# Altium project mother board.PrjPcb
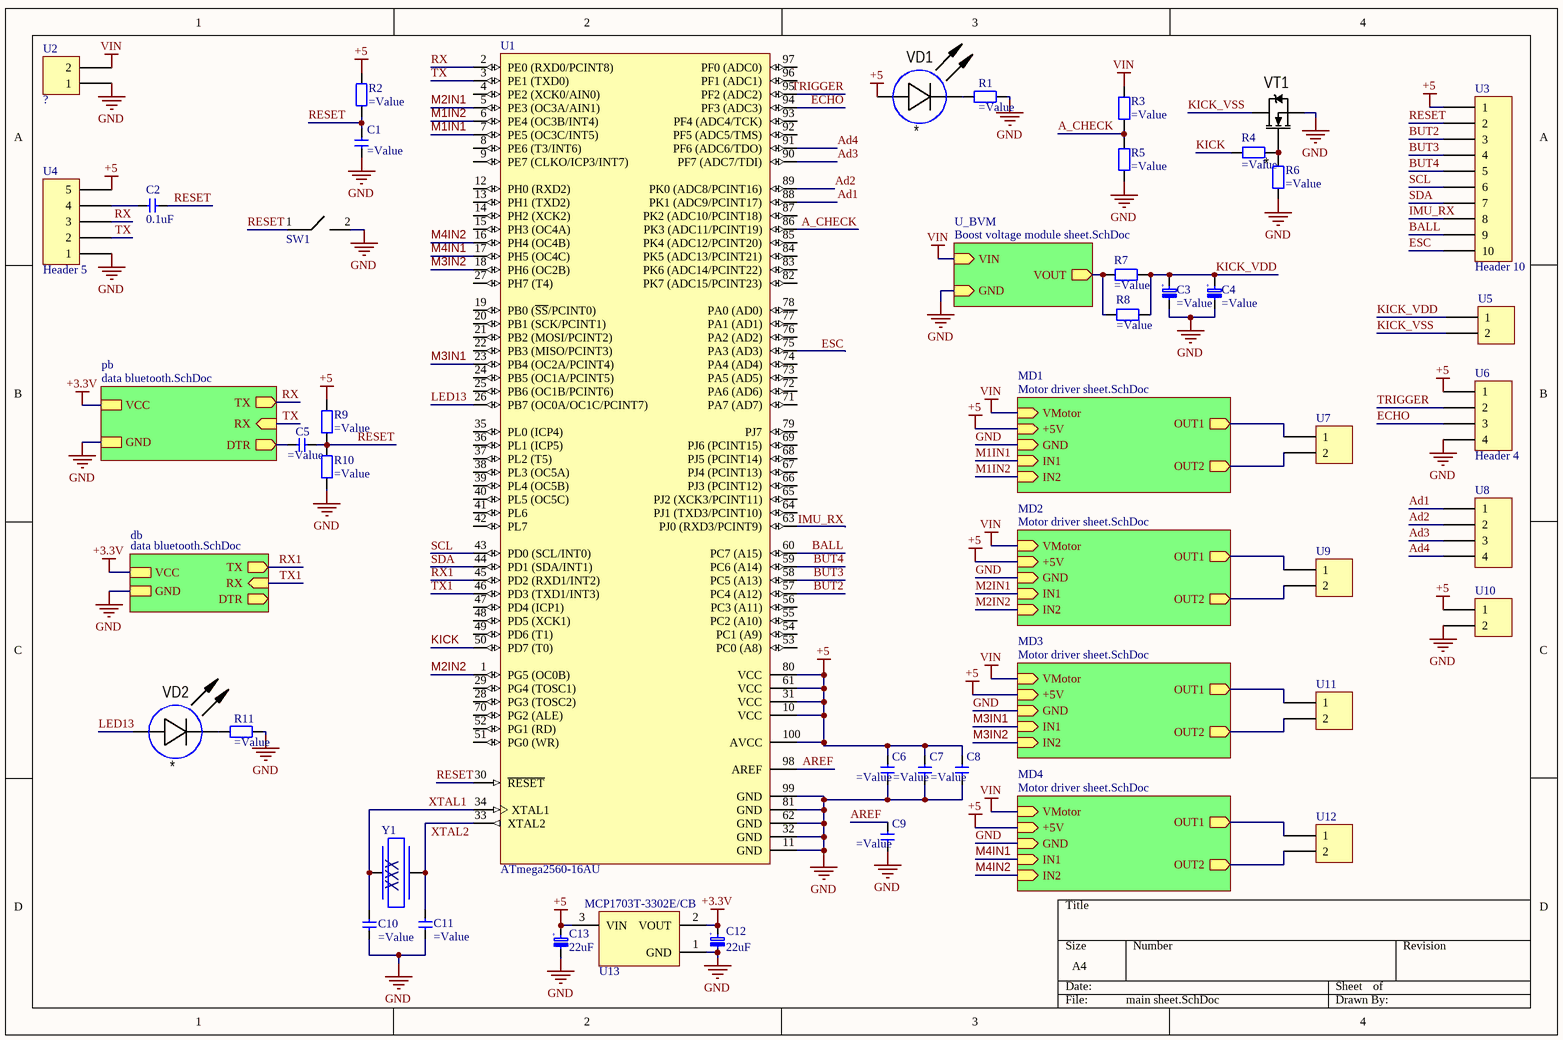
[diagram p0: main sheet.SchDoc]
4 sheets, 73 parts. Net scope: hierarchical (ports join the sheet entries above them; power ports are global).
Board file: mother board.PcbDoc
Sheets:
  main sheet.SchDoc
    MD1 = Motor driver sheet.SchDoc
    MD2 = Motor driver sheet.SchDoc
    MD3 = Motor driver sheet.SchDoc
    MD4 = Motor driver sheet.SchDoc
    db = data bluetooth.SchDoc
    pb = data bluetooth.SchDoc
    U_BVM = Boost voltage module sheet.SchDoc

## Sheet main sheet.SchDoc
size A4

### Parts
C1  (no value)  [cap0603]
C2  0.1uF  [cap0603]
C3  (no value)  [CAP63V2200uF]
C4  (no value)  [CAP63V2200uF]
C5  (no value)  [cap0603]
C6  (no value)  [cap0603]
C7  (no value)  [cap0603]
C8  (no value)  [cap0603]
C9  (no value)  [cap0603]
C10  (no value)  [cap0603]
C11  (no value)  [cap0603]
C12  22uF  [Tantal B]
C13  22uF  [Tantal B]
R1  (no value)  [res0603]
R2  (no value)  [res0603]
R3  (no value)  [res0603]
R4  (no value)  [res0603]
R5  (no value)  [res0603]
R6  (no value)  [res0603]
R7  (no value)  [smd2512]
R8  (no value)  [smd2512]
R9  (no value)  [res0603]
R10  (no value)  [res0603]
R11  (no value)  [res0603]
SW1  Switch  [Switch]  (value not drawn)
U1  ATmega2560-16AU  [100A_N]
U2  ?  [XT30]
U3  Header 10  [10x1.25]
U4  Header 5  [5x2.54]
U5  ?  [XT30]  (value not drawn)
U6  Header 4  [4x1.27]
U7  Header 2  [2x2.54]  (value not drawn)
U8  Header 4  [4x1.25]  (value not drawn)
U9  Header 2  [2x2.54]  (value not drawn)
U10  Header 2  [2x1.25]  (value not drawn)
U11  Header 2  [2x2.54]  (value not drawn)
U12  Header 2  [2x2.54]  (value not drawn)
U13  MCP1703T-3302E/CB  [SOT-23A-CB3_N]
VD1  *  [CH0603LB]
VD2  *  [CH0603LB]
VT1  *  [DPAK_132]
Y1  XXX  [QSMD3.2x2.5_A]

### Sub-sheets
db = data bluetooth.SchDoc: TX (out), GND, VCC, RX (in), DTR (out)
MD1 = Motor driver sheet.SchDoc: VMotor (in), +5V (in), GND (in), IN1 (in), IN2 (in), OUT1 (out), OUT2 (out)
MD2 = Motor driver sheet.SchDoc: VMotor (in), +5V (in), GND (in), IN1 (in), IN2 (in), OUT1 (out), OUT2 (out)
MD3 = Motor driver sheet.SchDoc: VMotor (in), +5V (in), GND (in), IN1 (in), IN2 (in), OUT1 (out), OUT2 (out)
MD4 = Motor driver sheet.SchDoc: VMotor (in), +5V (in), GND (in), IN1 (in), IN2 (in), OUT1 (out), OUT2 (out)
pb = data bluetooth.SchDoc: TX (out), RX (in), GND, VCC, DTR (out)
U_BVM = Boost voltage module sheet.SchDoc: VIN (in), GND (in), VOUT (out)

### Nets
+3.3V: C12.2(PLUS) U13.2(VOUT) ; sheet db/VCC, sheet pb/VCC
+5: C6.2 C7.2 C8.2 C13.2(PLUS) R2.2 R9.2 U1.10(VCC) U1.31(VCC) U1.61(VCC) U1.80(VCC) U1.100(AVCC) U3.1 U4.5 U6.1 U10.1 U13.3(VIN) VD1.1(A) ; sheet MD1/+5V, sheet MD2/+5V, sheet MD3/+5V, sheet MD4/+5V  [project net +5V]
GND: C1.1 C3.2(MINUS) C4.2(MINUS) C6.1 C7.1 C8.1 C9.1 C10.1 C11.1 C12.1(MINUS) C13.1(MINUS) R1.2 R5.1 R6.1 R10.1 R11.2 SW1.2 U1.11(GND) U1.32(GND) U1.62(GND) U1.81(GND) U1.99(GND) U2.1 U4.1 U6.4 U10.2 U13.1(GND) VT1.3(S) ; sheet MD1/GND, sheet MD2/GND, sheet MD3/GND, sheet MD4/GND, sheet db/GND, sheet pb/GND, sheet U_BVM/GND
VIN: R3.2 U2.2 ; sheet MD1/VMotor, sheet MD2/VMotor, sheet MD3/VMotor, sheet MD4/VMotor, sheet U_BVM/VIN  [project net VMotor]
VOUT: R7.1 R8.1 ; sheet U_BVM/VOUT
A_CHECK: R3.1 R5.2 U1.86(PK3_(ADC11/PCINT19))
Ad1: U1.88(PK1_(ADC9/PCINT17)) U8.1
Ad2: U1.89(PK0_(ADC8/PCINT16)) U8.2
Ad3: U1.90(PF7_(ADC7/TDI)) U8.3
Ad4: U1.91(PF6_(ADC6/TDO)) U8.4
AREF: C9.2 U1.98(AREF)
BALL: U1.60(PC7_(A15)) U3.9
BUT2: U1.57(PC4_(A12)) U3.3
BUT3: U1.58(PC5_(A13)) U3.4
BUT4: U1.59(PC6_(A14)) U3.5
ECHO: U1.94(PF3_(ADC3)) U6.3
ESC: U1.75(PA3_(AD3)) U3.10
IMU_RX: U1.63(PJ0_(RXD3/PCINT9)) U3.8
KICK: R4.1 U1.50(PD7_(T0))
KICK_VDD: C3.1(PLUS) C4.1(PLUS) R7.2 R8.2 U5.1
KICK_VSS: U5.2 VT1.2(D)
LED13: U1.26(PB7_(OC0A/OC1C/PCINT7)) VD2.1(A)
M1IN1: U1.7(PE5_(OC3C/INT5)) ; sheet MD1/IN1  [project net IN1]
M1IN2: U1.6(PE4_(OC3B/INT4)) ; sheet MD1/IN2  [project net IN2]
M2IN1: U1.5(PE3_(OC3A/AIN1)) ; sheet MD2/IN1  [project net IN1]
M2IN2: U1.1(PG5_(OC0B)) ; sheet MD2/IN2  [project net IN2]
M3IN1: U1.23(PB4_(OC2A/PCINT4)) ; sheet MD3/IN1  [project net IN1]
M3IN2: U1.18(PH6_(OC2B)) ; sheet MD3/IN2  [project net IN2]
M4IN1: U1.17(PH5_(OC4C)) ; sheet MD4/IN1  [project net IN1]
M4IN2: U1.16(PH4_(OC4B)) ; sheet MD4/IN2  [project net IN2]
OUT1: U7.1 ; sheet MD1/OUT1
OUT1: U9.1 ; sheet MD2/OUT1  [a separate net that carries the same name]
OUT1: U11.1 ; sheet MD3/OUT1  [a separate net that carries the same name]
OUT1: U12.1 ; sheet MD4/OUT1  [a separate net that carries the same name]
OUT2: U7.2 ; sheet MD1/OUT2
OUT2: U9.2 ; sheet MD2/OUT2  [a separate net that carries the same name]
OUT2: U11.2 ; sheet MD3/OUT2  [a separate net that carries the same name]
OUT2: U12.2 ; sheet MD4/OUT2  [a separate net that carries the same name]
RESET: C1.2 C2.2 C5.2 R2.1 R9.1 R10.2 SW1.1 U1.30(~{RESET}) U3.2
RX: U1.2(PE0_(RXD0/PCINT8)) U4.3 ; sheet pb/TX
RX1: U1.45(PD2_(RXD1/INT2)) ; sheet db/TX
SCL: U1.43(PD0_(SCL/INT0)) U3.6
SDA: U1.44(PD1_(SDA/INT1)) U3.7
TRIGGER: U1.95(PF2_(ADC2)) U6.2
TX: U1.3(PE1_(TXD0)) U4.2 ; sheet pb/RX
TX1: U1.46(PD3_(TXD1/INT3)) ; sheet db/RX
XTAL1: C10.2 U1.34(XTAL1) Y1.1
XTAL2: C11.2 U1.33(XTAL2) Y1.2
NetC2_1: C2.1 U4.4
NetC5_1: C5.1 ; sheet pb/DTR
NetR1_1: R1.1 VD1.2(C)
NetR4_2: R4.2 R6.2 VT1.1(G)
NetR11_1: R11.1 VD2.2(C)

Not connected (* = marked no-connect by the designer): U1 4(PE2_(XCK0/AIN0)) 8(PE6_(T3/INT6)) 9(PE7_(CLKO/ICP3/INT7)) 12(PH0_(RXD2)) 13(PH1_(TXD2)) 14(PH2_(XCK2)) 15(PH3_(OC4A)) 19(PB0_(~{SS}/PCINT0)) 20(PB1_(SCK/PCINT1)) 21(PB2_(MOSI/PCINT2)) 22(PB3_(MISO/PCINT3)) 24(PB5_(OC1A/PCINT5)) 25(PB6_(OC1B/PCINT6)) 27(PH7_(T4)) 28(PG3_(TOSC2)) 29(PG4_(TOSC1)) 35(PL0_(ICP4)) 36(PL1_(ICP5)) 37(PL2_(T5)) 38(PL3_(OC5A)) 39(PL4_(OC5B)) 40(PL5_(OC5C)) 41(PL6) 42(PL7) 47(PD4_(ICP1)) 48(PD5_(XCK1)) 49(PD6_(T1)) 51(PG0_(WR)) 52(PG1_(RD)) 53(PC0_(A8)) 54(PC1_(A9)) 55(PC2_(A10)) 56(PC3_(A11)) 64(PJ1_(TXD3/PCINT10)) 65(PJ2_(XCK3/PCINT11)) 66(PJ3_(PCINT12)) 67(PJ4_(PCINT13)) 68(PJ5_(PCINT14)) 69(PJ6_(PCINT15)) 70(PG2_(ALE)) 71(PA7_(AD7)) 72(PA6_(AD6)) 73(PA5_(AD5)) 74(PA4_(AD4)) 76(PA2_(AD2)) 77(PA1_(AD1)) 78(PA0_(AD0)) 79(PJ7) 82(PK7_(ADC15/PCINT23)) 83(PK6_(ADC14/PCINT22)) 84(PK5_(ADC13/PCINT21)) 85(PK4_(ADC12/PCINT20)) 87(PK2_(ADC10/PCINT18)) 92(PF5_(ADC5/TMS)) 93(PF4_(ADC4/TCK)) 96(PF1_(ADC1)) 97(PF0_(ADC0))

### Notes on the sheet
- (in symbol Cap Aluminum) +
- (in symbol Cap Tantal) +

### Library data of the parts
C1 C2 C5-C11 = Cap SMD
C3 C4 = Cap Aluminum
C12 C13 = Cap Tantal
R1-R11 = Resistor SMD
U1 = ATmega2560-16AU: 8-bit AVR Microcontroller, 4.5-5.5V, 256KB Flash, 4KB EEPROM, 8KB SRAM, 86 GPIO pins, 100-pin TQFP, Industrial Grade (-40°C to 85°C), Pb-Free; Published: 1-Apr-2010; DatasheetVersion: revL, Aug-2007; PackageVersion: revC, Oct-2001; PackageReference: 100A; Publisher: Altium Limited; PackageDescription: 100-Pin Thin Profile Plastic Quad Flat Pack (TQFP), 14 x 14 x 1.0 mm Body, 0.5 mm Pitch; Supplier 1: Digi-Key; Supplier Part Number 1: ATMEGA2560-16AU-ND; Supplier 2: Farnell; Supplier Part Number 2: 1288330; Supplier 3: Farnell; Supplier Part Number 3: 1661740; Supplier 4: Mouser; Supplier Part Number 4: 556-ATMEGA2560-16AU; Code_JEDEC: MS-026-AED; ComponentLink1Description: Manufacturer Link; ComponentLink1URL: http://www.atmel.com/products/avr/default.asp?; ComponentLink2Description: ATmega640/1280/1281/2560/2561 Datasheet; ComponentLink2URL: http://www.atmel.com/dyn/resources/prod_documents/doc2549.pdf; ComponentLink3Description: ATmega640/1280/1281/2560/2561 Summary; ComponentLink3URL: http://www.atmel.com/dyn/resources/prod_documents/2549S.pdf; ComponentLink4Description: Atmel.com Home; ComponentLink4URL: http://www.atmel.com
U2 U5 = Power connectors
U13 = MCP1703T-3302E/CB: 250 mA, 16V, Low Quiescent Current LDO Regulator, 3-Pin SOT-23A, Extended Temperature, Tape and Reel; Published: 29-Jan-2009; DatasheetVersion: revD, Sep-2009; PackageVersion: revBB, Aug-2009; PackageReference: SOT-23A-CB3; Publisher: Altium Limited; PackageDescription: 3-Lead Plastic Small Outline Transistor (CB) [SOT-23A]; Supplier 1: Digi-Key; Supplier Part Number 1: MCP1703T-3302E/CBTR-ND; Supplier 2: Digi-Key; Supplier Part Number 2: MCP1703T-3302E/CBCT-ND; Supplier 3: Digi-Key; Supplier Part Number 3: MCP1703T-3302E/CBDKR-ND; Supplier 4: Farnell; Supplier Part Number 4: 1439518; ComponentLink1Description: Datasheet; ComponentLink1URL: http://ww1.microchip.com/downloads/en/DeviceDoc/22049d.pdf; ComponentLink2Description: Packaging Specification; ComponentLink2URL: http://www.microchip.com/stellent/groups/techpub_sg/documents/packagingspec/en012702.pdf; ComponentLink3Description: Microchip.com Home; ComponentLink3URL: http://www.microchip.com/
VD1 VD2 = LED: Manufacturer: *; Model: *; HelpURL: *; ComponentKind: *; Value: *
VT1 = N-chanel: Mosfet; Model: *; Manufacturer: *; ComponentKind: *; HelpURL: *
Y1 = Crystal: Кварцевый резонатор; Value: XXX

## Sheet Motor driver sheet.SchDoc
size A4
Used 4 times, as channels MD1, MD2, MD3, MD4. Parts and nets are listed once, with the designators drawn on the sheet.
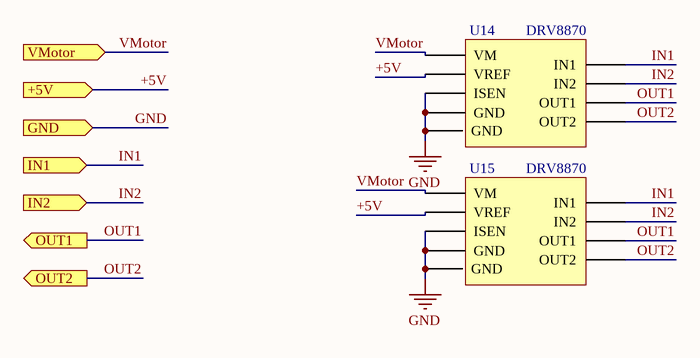
[diagram p1: Motor driver sheet.SchDoc]

### Parts
U14  DRV8870  [8-Pin HSOP]
U15  DRV8870  [8-Pin HSOP]

### Ports
+5V (in), GND (in), IN1 (in), IN2 (in), OUT1 (out), OUT2 (out), VMotor (in)

### Nets
GND: U14.1(GND) U14.7(ISEN) U14.9(GND) U15.1(GND) U15.7(ISEN) U15.9(GND) ; port GND
+5V: U14.4(VREF) U15.4(VREF) ; port +5V
IN1: U14.2(IN1) U15.2(IN1) ; port IN1
IN2: U14.3(IN2) U15.3(IN2) ; port IN2
OUT1: U14.6(OUT1) U15.6(OUT1) ; port OUT1
OUT2: U14.8(OUT2) U15.8(OUT2) ; port OUT2
VMotor: U14.5(VM) U15.5(VM) ; port VMotor

### Channels
MD1: designators end in _MD1; ports +5V=+5V GND=GND IN1=IN1 IN2=IN2 OUT1=OUT1 OUT2=OUT2 VMotor=VMotor
MD2: designators end in _MD2; ports +5V=+5V GND=GND IN1=IN1 IN2=IN2 OUT1=OUT1 OUT2=OUT2 VMotor=VMotor
MD3: designators end in _MD3; ports +5V=+5V GND=GND IN1=IN1 IN2=IN2 OUT1=OUT1 OUT2=OUT2 VMotor=VMotor
MD4: designators end in _MD4; ports +5V=+5V GND=GND IN1=IN1 IN2=IN2 OUT1=OUT1 OUT2=OUT2 VMotor=VMotor

### Library data of the parts
U14 U15 = DRV8870: pin to pad: 8>8+9

## Sheet data bluetooth.SchDoc
size A2
Used 2 times, as channels db, pb. Parts and nets are listed once, with the designators drawn on the sheet.
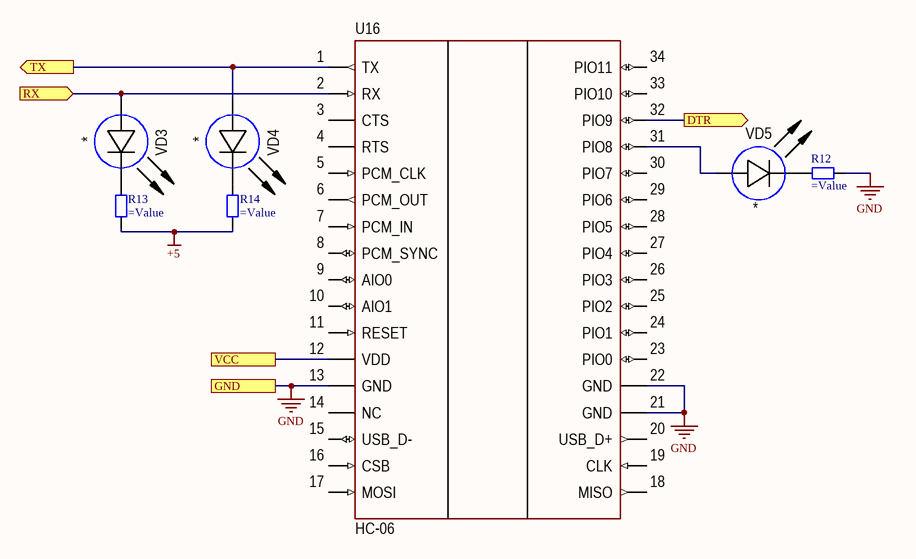
[diagram p2: data bluetooth.SchDoc]

### Parts
R12  (no value)  [res0603]
R13  (no value)  [res0603]
R14  (no value)  [res0603]
U16  HC-06  [MOD: HC-05]
VD3  *  [CH0603LB]
VD4  *  [CH0603LB]
VD5  *  [CH0603LB]

### Ports
DTR (out), GND, RX (in), TX (out), VCC

### Nets
+5: R13.1 R14.1
GND: R12.1 U16.13(GND) U16.21(GND) U16.22(GND) ; port GND
DTR: U16.32(PIO9) ; port DTR
RX: U16.2(RX) VD3.1(A) ; port RX
TX: U16.1(TX) VD4.1(A) ; port TX
VCC: U16.12(VDD) ; port VCC
NetR12_2: R12.2 VD5.2(C)
NetR13_2: R13.2 VD3.2(C)
NetR14_2: R14.2 VD4.2(C)
NetU16_31: U16.31(PIO8) VD5.1(A)

Not connected (* = marked no-connect by the designer): U16 3(CTS) 4(RTS) 5(PCM_CLK) 6(PCM_OUT) 7(PCM_IN) 8(PCM_SYNC) 9(AIO0) 10(AIO1) 11(RESET) 14(NC) 15(USB_D-) 16(CSB) 17(MOSI) 18(MISO) 19(CLK) 20(USB_D+) 23(PIO0) 24(PIO1) 25(PIO2) 26(PIO3) 27(PIO4) 28(PIO5) 29(PIO6) 30(PIO7) 33(PIO10) 34(PIO11)

### Channels
db: designators end in _db; ports DTR=NetU16_db_32 GND=GND RX=TX1 TX=RX1 VCC=+3.3V
pb: designators end in _pb; ports DTR=NetC5_1 GND=GND RX=TX TX=RX VCC=+3.3V

### Library data of the parts
R12-R14 = Resistor SMD
U16 = HC-06: Bluetooth; Manufacturer: China; Model: HC-06; ComponentKind: Bluetooth 2.4GHz; HelpURL: https://ru.aliexpress.com/wholesale?minPrice=&maxPrice=&isBigSale=n&isFreeShip=y&isNew=n&isFavorite=n&isMobileExclusive=n&isLocalReturn=n&shipFromCountry=&shipCompanies=&SearchText=HC-06&CatId=0&initiative_id=SB_20170806222546&needQuery=y
VD3-VD5 = LED: Manufacturer: *; Model: *; HelpURL: *; ComponentKind: *; Value: *

## Sheet Boost voltage module sheet.SchDoc
size A4
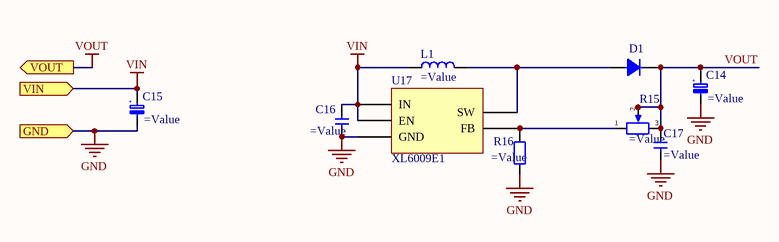
[diagram p3: Boost voltage module sheet.SchDoc]

### Parts
C14  (no value)  [D8C3.2H12]
C15  (no value)  [D8C3.2H12]
C16  (no value)  [cap0603]
C17  (no value)  [cap0603]
D1  Diode SMD  [SOD123]  (value not drawn)
L1  (no value)  [SRR1280]
R15  (no value)  [3224W]
R16  (no value)  [res0603]
U17  XL6009E1  [TO263-5L]

### Ports
GND (in), VIN (in), VOUT (out)

### Nets
GND: C14.2(MINUS) C15.2(MINUS) C16.2 C17.2 R16.1 U17.1(GND) ; port GND
VIN: C15.1(PLUS) C16.1 L1.1 U17.2(EN) U17.4(IN) ; port VIN  [project net VMotor]
VOUT: C14.1(PLUS) C17.1 D1.2 R15.2 R15.3 ; port VOUT
NetD1_1: D1.1 L1.2 U17.3(SW)
NetR15_1: R15.1 R16.2 U17.5(FB)

### Notes on the sheet
- (in symbol Cap Aluminum) +

### Library data of the parts
C14 C15 = Cap Aluminum
C16 C17 = Cap SMD
L1 = Inductor
R15 = Potentiometer
R16 = Resistor SMD

## Nets that join several sheets
+3.3V: main sheet (C12.2 U13.2), db (U16_db.12), pb (U16_pb.12)
+5V: main sheet (17 pins), MD1 (U14_MD1.4 U15_MD1.4), MD2 (U14_MD2.4 U15_MD2.4), MD3 (U14_MD3.4 U15_MD3.4), MD4 (U14_MD4.4 U15_MD4.4), db (R13_db.1 R14_db.1), pb (R13_pb.1 R14_pb.1)
GND: main sheet (28 pins), MD1 (6 pins), MD2 (6 pins), MD3 (6 pins), MD4 (6 pins), db (R12_db.1 U16_db.13 U16_db.21 U16_db.22), pb (R12_pb.1 U16_pb.13 U16_pb.21 U16_pb.22), Boost voltage module sheet (6 pins)
VMotor: main sheet (R3.2 U2.2), MD1 (U14_MD1.5 U15_MD1.5), MD2 (U14_MD2.5 U15_MD2.5), MD3 (U14_MD3.5 U15_MD3.5), MD4 (U14_MD4.5 U15_MD4.5), Boost voltage module sheet (5 pins)
VOUT: main sheet (R7.1 R8.1), Boost voltage module sheet (5 pins)
IN1: main sheet (U1.7), MD1 (U14_MD1.2 U15_MD1.2)
IN1: main sheet (U1.23), MD3 (U14_MD3.2 U15_MD3.2)
IN1: main sheet (U1.5), MD2 (U14_MD2.2 U15_MD2.2)
IN1: main sheet (U1.17), MD4 (U14_MD4.2 U15_MD4.2)
IN2: main sheet (U1.1), MD2 (U14_MD2.3 U15_MD2.3)
IN2: main sheet (U1.6), MD1 (U14_MD1.3 U15_MD1.3)
IN2: main sheet (U1.16), MD4 (U14_MD4.3 U15_MD4.3)
IN2: main sheet (U1.18), MD3 (U14_MD3.3 U15_MD3.3)
NetC5_1: main sheet (C5.1), pb (U16_pb.32)
OUT1: main sheet (U7.1), MD1 (U14_MD1.6 U15_MD1.6)
OUT1: main sheet (U9.1), MD2 (U14_MD2.6 U15_MD2.6)
OUT1: main sheet (U11.1), MD3 (U14_MD3.6 U15_MD3.6)
OUT1: main sheet (U12.1), MD4 (U14_MD4.6 U15_MD4.6)
OUT2: main sheet (U7.2), MD1 (U14_MD1.8 U15_MD1.8)
OUT2: main sheet (U9.2), MD2 (U14_MD2.8 U15_MD2.8)
OUT2: main sheet (U11.2), MD3 (U14_MD3.8 U15_MD3.8)
OUT2: main sheet (U12.2), MD4 (U14_MD4.8 U15_MD4.8)
RX: main sheet (U1.2 U4.3), pb (U16_pb.1 VD4_pb.1)
RX1: main sheet (U1.45), db (U16_db.1 VD4_db.1)
TX: main sheet (U1.3 U4.2), pb (U16_pb.2 VD3_pb.1)
TX1: main sheet (U1.46), db (U16_db.2 VD3_db.1)